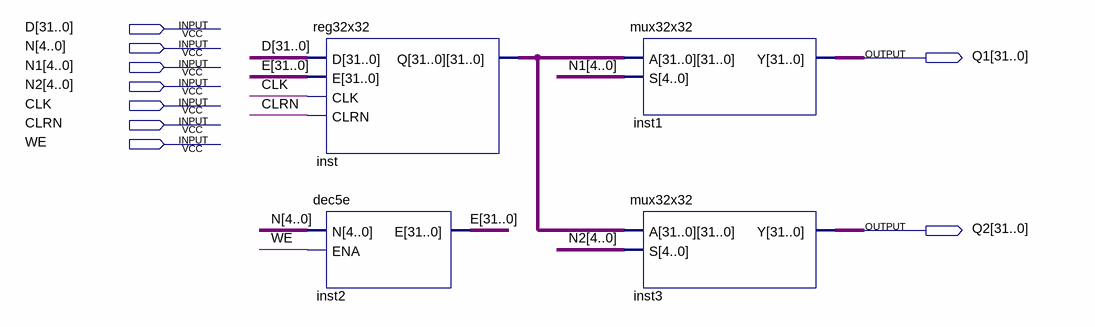
[diagram p0: schematic sheet]
// Quartus schematic regfile32x32.bdf as structural Verilog: 4 symbols, 9 pins
module regfile32x32 (
  input  [31:0] D,
  input  [4:0] N,
  input  [4:0] N1,
  input  [4:0] N2,
  input  CLK,
  input  CLRN,
  input  WE,
  output [31:0] Q1,
  output [31:0] Q2
);

  wire [31:0] E;
  wire [1023:0] inst_q;

  reg32x32 inst (.D(D), .E(E), .CLK(CLK), .CLRN(CLRN), .Q(inst_q));
  dec5e inst2 (.N(N), .ENA(WE), .E(E));
  mux32x32 inst1 (.A(inst_q), .S(N1), .Y(Q1));
  mux32x32 inst3 (.A(inst_q), .S(N2), .Y(Q2));
endmodule
